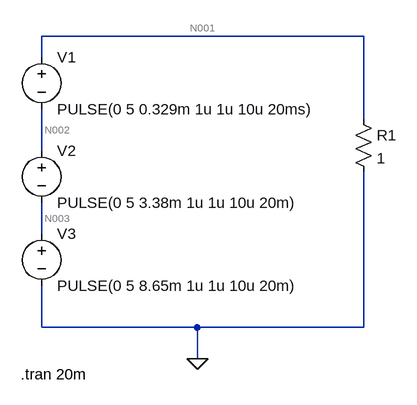
[diagram p0: schematic Draft1.asc]
Draft1.asc, the LTspice schematic file:
Version 4
SHEET 1 880 680
WIRE 464 -64 -32 -64
WIRE -32 -32 -32 -64
WIRE 464 64 464 -64
WIRE -32 112 -32 48
WIRE -32 240 -32 192
WIRE -32 384 -32 320
WIRE 208 384 -32 384
WIRE 464 384 464 144
WIRE 464 384 208 384
WIRE 208 432 208 384
FLAG 208 432 0
DATAFLAG 128 -64 ""
SYMBOL voltage -32 -48 R0
WINDOW 123 0 0 Left 0
WINDOW 39 0 0 Left 0
SYMATTR InstName V1
SYMATTR Value PULSE(0 5 0.329m 1u 1u 10u 20ms)
SYMBOL voltage -32 96 R0
WINDOW 123 0 0 Left 0
WINDOW 39 0 0 Left 0
SYMATTR InstName V2
SYMATTR Value PULSE(0 5 3.38m 1u 1u 10u 20m)
SYMBOL voltage -32 224 R0
WINDOW 123 0 0 Left 0
WINDOW 39 0 0 Left 0
SYMATTR InstName V3
SYMATTR Value PULSE(0 5 8.65m 1u 1u 10u 20m)
SYMBOL res 448 48 R0
SYMATTR InstName R1
SYMATTR Value 1
TEXT -64 456 Left 2 !.tran 20m

The netlist it stands for:
* Draft1.asc
V1 N001 N002 PULSE(0 5 0.329m 1u 1u 10u 20ms)
V2 N002 N003 PULSE(0 5 3.38m 1u 1u 10u 20m)
V3 N003 0 PULSE(0 5 8.65m 1u 1u 10u 20m)
R1 N001 0 1
.tran 20m
.backanno
.end

* Results of the author's LTspice run, read from the files saved beside the schematic
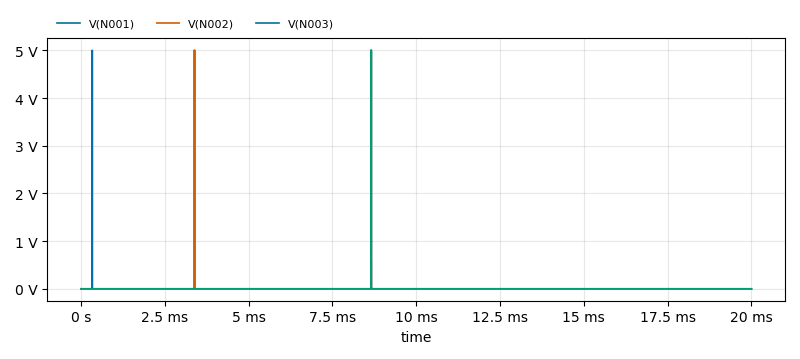
[diagram p1: Transient Analysis of Draft1.asc, plotted from the saved traces]
* Transient Analysis, 1 run:
*   V(N001): min 0 V, max 5 V, average 8.25 mV, rms 203.1 mV, last 0 V
*   V(N002): min 0 V, max 5 V, average 5.5 mV, rms 165.8 mV, last 0 V
*   V(N003): min 0 V, max 5 V, average 2.75 mV, rms 117.3 mV, last 0 V